# EAGLE design LCmeter0-LCD-8pinlcd-PICCOMP (EAGLE 7.2.0)
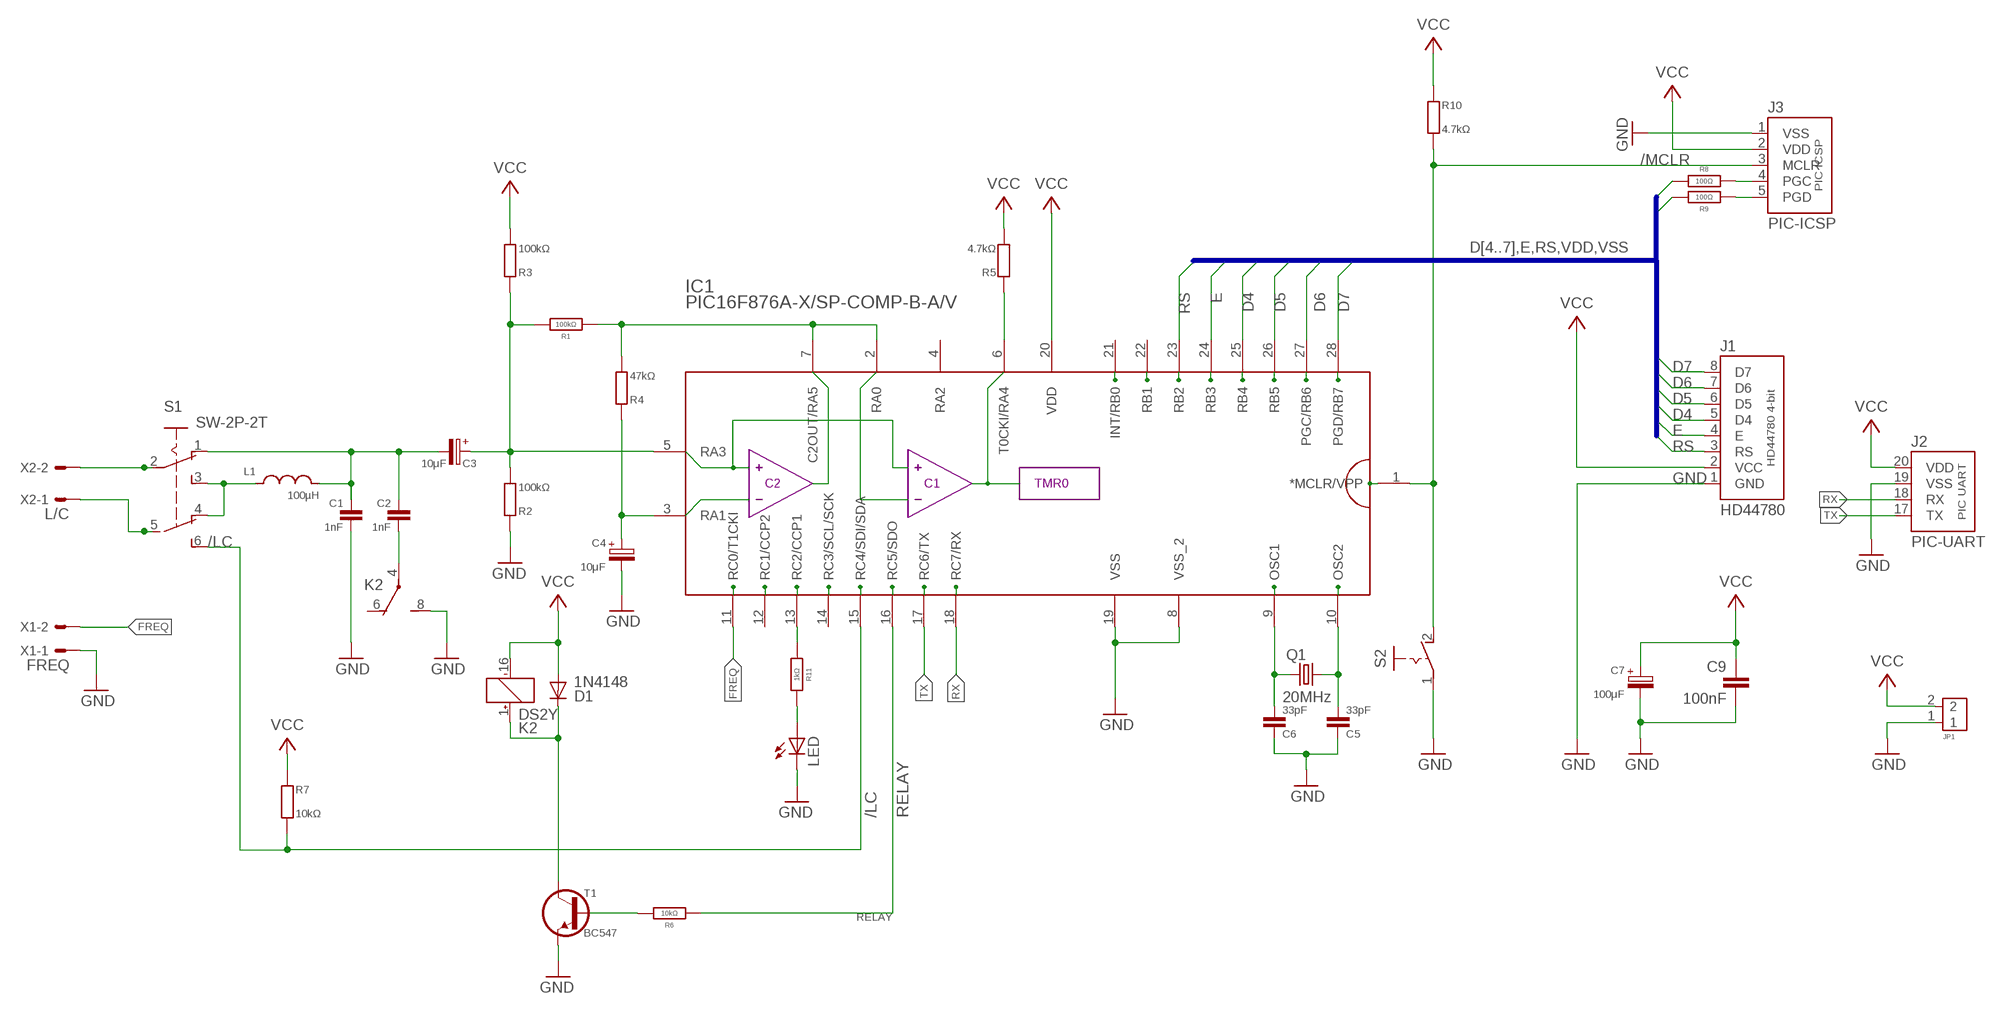
[diagram p0: schematic, sheet 1]

## Parts
C1  1nF  C050-020X036  [C050-020X036]
C2  1nF  C050-020X036  [C050-020X036]
C3  10μF  CPOL-HE2,5-4  [E2,5-4]
C4  10μF  CPOLE2,5-4  [E2,5-4]
C5  33pF  C025-020X036  [C025-020X036]
C6  33pF  C025-020X036  [C025-020X036]
C7  100μF  CPOLE2.5-5  [E2,5-5]
C9  100nF  C-EU025-024X044  [C025-024X044]
D1  1N4148  1N414834-7  [DO34-7]
IC1  PIC16F876A-X/SP-COMP-B-A/V  [DIL28-3/V]
J1  HD44780  HD44780-4BIT-8PIN  [CONN-8P]
J2  PIC-UART  [PIC-UART]
J3  PIC-ICSP  [CONN-5P]
JP1  CONN-2P2P/V  [CONN-2P-V]
K2  DS2Y  DS2Y-S-DC5V  [DS2Y]
L1  100µH  L-SHORT02/7V  [L-02/7V]
LED  TLLG4400  [LED3MM]
Q1  20MHz  CRYSTALHC49  [HC49]
R1  100kΩ  R-H0204/10  [0204/10]
R2  100kΩ  R0204/10  [0204/10]
R3  100kΩ  R0204/10  [0204/10]
R4  47kΩ  R0204/10  [0204/10]
R5  4.7kΩ  R0204/10  [0204/10]
R6  10kΩ  R-H0204/10  [0204/10]
R7  10kΩ  R0204/10-V  [0204/10-V]
R8  100Ω  R-H0204/10  [0204/10]
R9  100Ω  R-H0204/10  [0204/10]
R10  4.7kΩ  R0204/10  [0204/10]
R11  1kΩ  R-H0204/10  [0204/10]
S1  SW-2P-2T  [SLSW-2P2T]
S2  PB-1P-1T  [PB-1P1T]
T1  BC547  [TO92-CBE]
X1  FREQ  C-GRID-02-70543  [70543-02]
X2  L/C  C-GRID-02-70543  [70543-02]

## Nets
/LC: IC1.15(RC4/SDI/SDA) R7.2 S1.6(S1)
/MCLR: IC1.1(*MCLR/VPP) J3.3(MCLR) R10.2 S2.2(S)
/RELAY: D1.C K2.1(1:+) T1.C
A0: IC1.2(RA0) IC1.7(C2OUT/RA5) R1.1 R4.2
A1: C4.+ IC1.3(RA1) R4.1
A3: C3.+ IC1.5(RA3) R1.2 R2.2 R3.1
A4: IC1.6(T0CKI/RA4) R5.1
C2_CON: C2.2 K2.4(2:P)
D4: IC1.25(RB4) J1.5(D4)
D5: IC1.26(RB5) J1.6(D5)
D6: IC1.27(PGC/RB6) J1.7(D6) R9.1
D7: IC1.28(PGD/RB7) J1.8(D7) R8.1
E: IC1.24(RB3) J1.4(E)
FREQ: IC1.11(RC0/T1CKI) X1.2
GND: C1.2 C4.- C5.1 C6.1 C7.- C9.2 IC1.8(VSS_2) IC1.19(VSS) J1.1(GND) J2.19(VSS) J3.1(VSS) JP1.1 K2.8(2:S) LED.K(C) R2.1 S2.1(P) T1.E X1.1
M+: S1.2(P) X2.2
M-: S1.5(P1) X2.1
N$1: J3.4(PGC) R8.2
N$2: C1.1 C2.1 C3.- L1.2 S1.1(O)
N$3: J3.5(PGD) R9.2
N$4: IC1.13(RC2/CCP1) R11.2
N$5: R6.1 T1.B
N$6: LED.A R11.1
N$7: L1.1 S1.3(S) S1.4(O1)
OSC1: C6.2 IC1.9(OSC1) Q1.1
OSC2: C5.2 IC1.10(OSC2) Q1.2
RELAY: IC1.16(RC5/SDO) R6.2
RS: IC1.23(RB2) J1.3(RS)
RX: IC1.18(RC7/RX) J2.18(RX)
TX: IC1.17(RC6/TX) J2.17(TX)
VCC: C7.+ C9.1 D1.A IC1.20(VDD) J1.2(VCC) J2.20(VDD) J3.2(VDD) JP1.2 K2.16(1:-) R3.2 R5.2 R7.1 R10.1
Unconnected: IC1.4(RA2) IC1.12(RC1/CCP2) IC1.14(RC3/SCL/SCK) IC1.21(INT/RB0) IC1.22(RB1) K2.6(2:O) K2.9(3:S) K2.11(3:O) K2.13(3:P)

## Buses
D[4..7],E,RS,VDD,VSS

## Library data of the parts
C1 C2 C5 C6 = c:C: CAPACITOR, European symbol
C3 = c:CPOL-H
C4 C7 = c:CPOL: POLARIZED CAPACITOR, European symbol
C9 = rcl:C-EU: CAPACITOR, European symbol
D1 = d:1N4148
IC1 = mcu:PIC16F876A-X/SP-COMP-B-A
J1 = pinconn:HD44780-4BIT
J2 = pinconn:PIC-UART
J3 = pinconn:PIC-ICSP
JP1 = pinconn:CONN-2P
K2 = relay:DS2Y-S-DC*: MINIATURE RELAY NAiS Source: http://www.mew-europe.com/.. en_ds_61005_0023.pdf; MPN: DS2Y-S-DC5V; OC_FARNELL: unknown; OC_NEWARK: 13P3268
L1 = l:L-SHORT
LED = led:TLLG4400: Low Current (2mA) LED 3 mm Tinted Diffused Package color GREEN Source: Data sheet <http://www.farnell.com/datasheets/391098.pdf>; MF: VISHAY SEMICONDUCTOR; OC_FARNELL: 1612435
Q1 = q:CRYSTAL
R1 R6 R8 R9 R11 = r:R-H
R2-R5 R7 R10 = r:R: RESISTOR, European symbol
S1 = sw:SW-2P-2T
S2 = sw:PB-1P-1T
T1 = t:BC547
X1 X2 = con-molex:C-GRID-02: CONNECTOR wire to board 2.54 mm (0.100") pitch header; OC_FARNELL: unknown; OC_NEWARK: unknown

## Net classes
0 default: clearance 0.381 mm

## Board
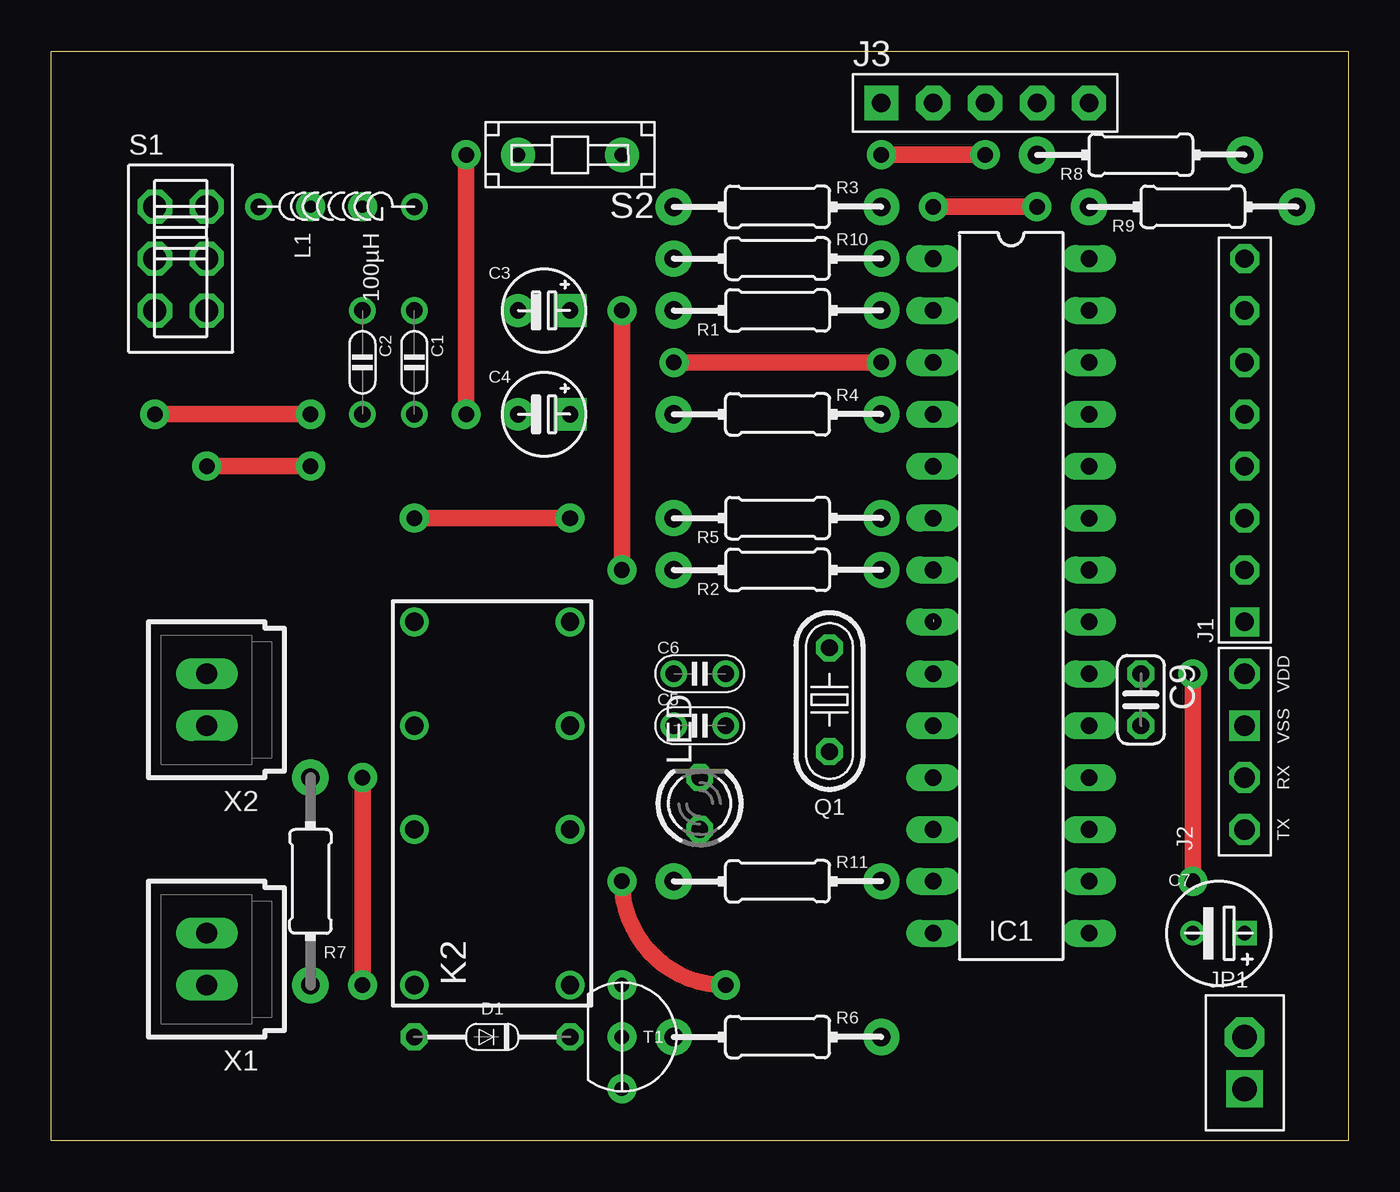
[diagram p1: board, top side]
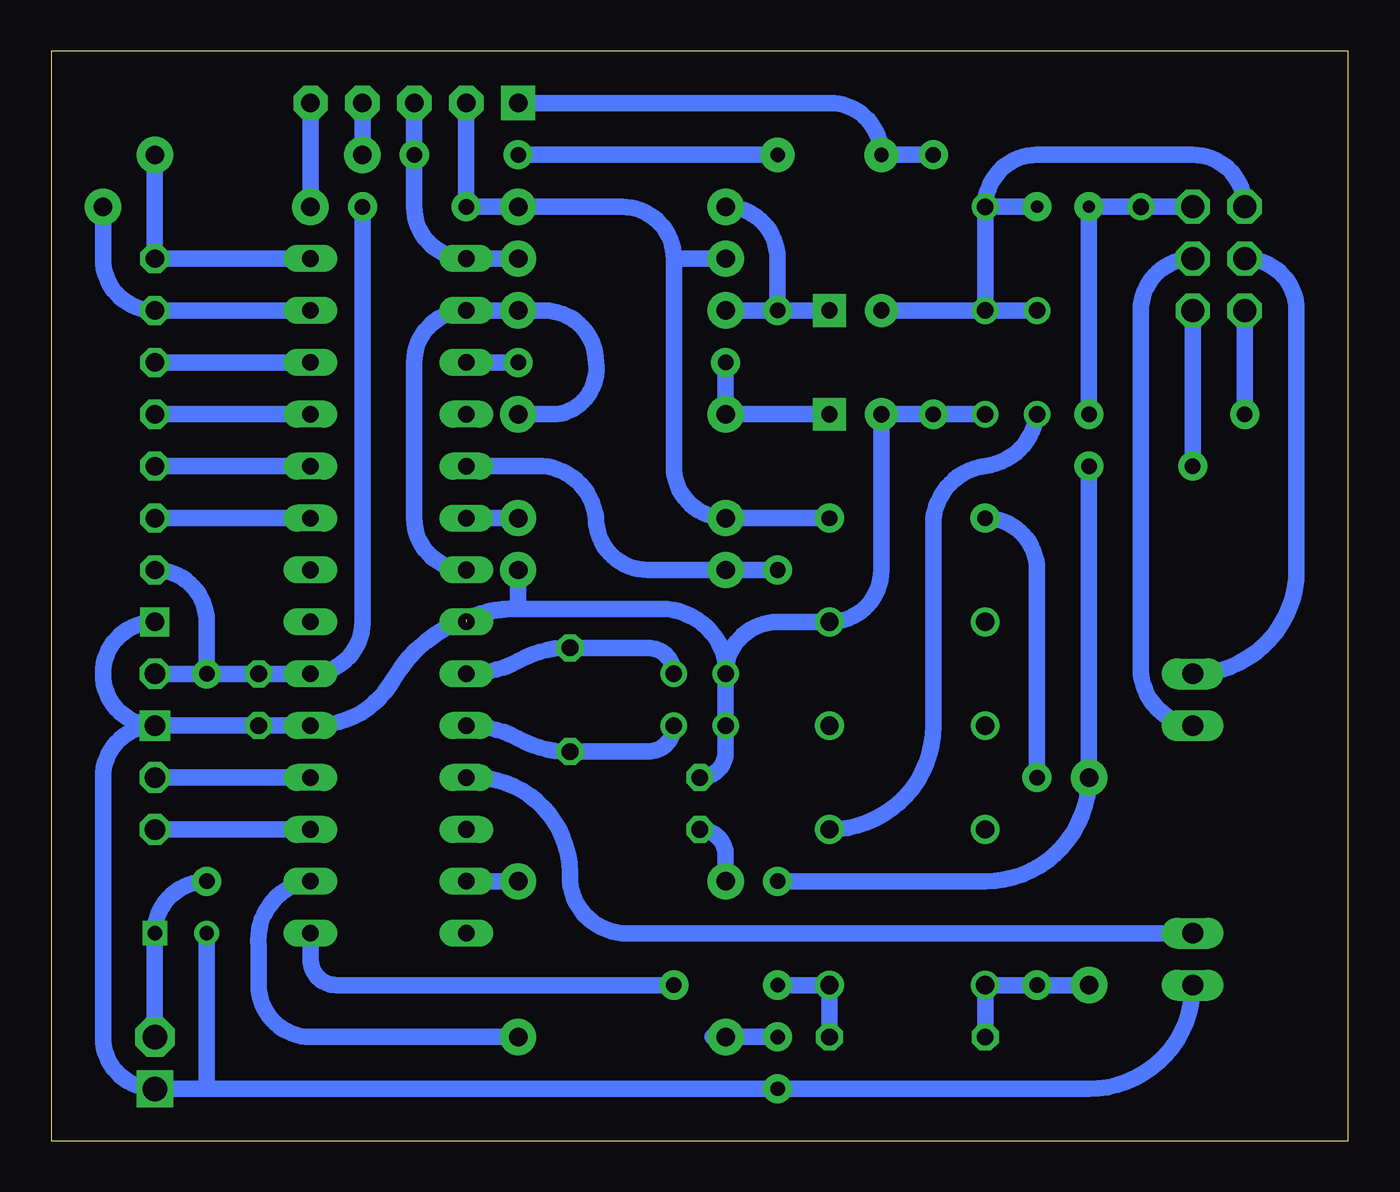
[diagram p2: board, bottom side, seen from below]

Size 63.5 x 53.34 mm. Coordinates in mm from the lower left corner, seen from the top.
Outline: 0,0 0,53.34 63.5,53.34 63.5,0 0,0
Copper layers (1*16): Top 0.035mm / dielectric 1.5mm / Bottom 0.035mm
Design rules "default": minimum track width 10mil, minimum drill 24mil, track to track 8mil, track to pad 8mil, pad to pad 8mil, via to via 8mil, smd to smd 8mil, copper to edge 40mil, drill to drill 8mil, minimum pad ring 10mil, minimum via ring 8mil, stop-mask expansion 4mil, vias tented up to drill 0mil, thermal gap 10mil

### Footprints (pad centres in the part's own frame; a part is rotated, then mirrored left to right if it is on the bottom)
C050-020X036 = drill 0.8: 1 -2.54,0; 2 2.54,0
E2,5-4 = drill 0.8 pad 1.6 square: + 1.27,0 | drill 0.8 pad 1.6: - -1.27,0
C025-020X036 = drill 0.8: 1 0,0; 2 2.54,0
E2,5-5 = drill 0.7 square: + 1.27,0 | drill 0.7: - -1.27,0
C025-024X044 = drill 0.813 octagon: 1 -1.27,0; 2 1.27,0
DO34-7 = drill 0.813 octagon: A -3.81,0; C 3.81,0
DIL28-3/V = drill 0.813 long: 1 -3.81,16.51; 2 -3.81,13.97; 3 -3.81,11.43; 4 -3.81,8.89; 5 -3.81,6.35; 6 -3.81,3.81; 7 -3.81,1.27; 8 -3.81,-1.27; 9 -3.81,-3.81; 10 -3.81,-6.35; 11 -3.81,-8.89; 12 -3.81,-11.43; 13 -3.81,-13.97; 14 -3.81,-16.51; 15 3.81,-16.51; 16 3.81,-13.97; 17 3.81,-11.43; 18 3.81,-8.89; 19 3.81,-6.35; 20 3.81,-3.81; 21 3.81,-1.27; 22 3.81,1.27; 23 3.81,3.81; 24 3.81,6.35; 25 3.81,8.89; 26 3.81,11.43; 27 3.81,13.97; 28 3.81,16.51
CONN-8P = drill 0.9 pad 1.422 square: 1 0,0 | drill 0.9 pad 1.422 octagon: 2 2.54,0; 3 5.08,0; 4 7.62,0; 5 10.16,0; 6 12.7,0; 7 15.24,0; 8 17.78,0
PIC-UART = drill 1 octagon: 17 0,0; 18 0,2.54; 20 0,7.62 | drill 1 square: 19 0,5.08
CONN-5P = drill 0.9 pad 1.676 square: 1 0,0 | drill 0.9 pad 1.676 octagon: 2 2.54,0; 3 5.08,0; 4 7.62,0; 5 10.16,0
CONN-2P-V = drill 1.2 pad 1.778 square: 1 0,-1.27 | drill 1.2 pad 1.93 octagon: 2 0,1.27
DS2Y = drill 0.9: 1 -8.89,-3.81; 4 -1.27,-3.81; 6 3.81,-3.81; 8 8.89,-3.81; 9 8.89,3.81; 11 3.81,3.81; 13 -1.27,3.81; 16 -8.89,3.81
L-02/7V = drill 0.8: 1 0,3.81; 2 0,-3.81
LED3MM = drill 0.813 octagon: A -1.27,0; K 1.27,0
HC49 = drill 0.813 octagon: 1 0,-2.54; 2 0,2.54
0204/10 = drill 0.9 pad 1.778: 1 -5.08,0; 2 5.08,0
0204/10-V = drill 0.9 pad 1.778: 1 0,5.08; 2 0,-5.08
SLSW-2P2T = drill 1.118 pad 1.524 octagon: 1 2.54,1.27; 2 0,1.27; 3 -2.54,1.27; 4 2.54,-1.27; 5 0,-1.27; 6 -2.54,-1.27
PB-1P1T = drill 0.7 pad 1.676: 1 2.54,0; 2 -2.54,0
TO92-CBE = drill 0.7 pad 1.422: B 0,0; C 0,2.54; E 0,-2.54
70543-02 = drill 1.016 long: 1 -1.27,0; 2 1.27,0

### Placement (x,y rotation side)
C1  17.78,38.1 270 top
C2  15.24,38.1 270 top
C3  24.13,40.64 0 top
C4  24.13,35.56 0 top
C5  30.48,20.32 0 top
C6  30.48,22.86 0 top
C7  57.15,10.16 0 top
C9  53.34,21.59 270 top
D1  21.59,5.08 0 top
IC1  46.99,26.67 0 top
J1  58.42,25.4 90 top
J2  58.42,15.24 0 top
J3  40.64,50.8 0 top
JP1  58.42,3.81 0 top
K2  21.59,16.51 90 top
L1  13.97,45.72 90 top
LED  31.75,16.51 90 top
Q1  38.1,21.59 180 top
R1  35.56,40.64 180 top
R2  35.56,27.94 180 top
R3  35.56,45.72 0 top
R4  35.56,35.56 0 top
R5  35.56,30.48 180 top
R6  35.56,5.08 0 top
R7  12.7,12.7 180 top
R8  53.34,48.26 180 top
R9  55.88,45.72 180 top
R10  35.56,43.18 0 top
R11  35.56,12.7 0 top
S1  6.35,43.18 90 top
S2  25.4,48.26 180 top
T1  27.94,5.08 0 top
X1  7.62,8.89 90 top
X2  7.62,21.59 90 top

### Tracks (layer width: path | path; a pad name or v marks a point on that pad's centre or on a via)
/LC  (via drill 0.76 pad 1.42)
  Top 0.813: v33.02,7.62 arc-90 v27.94,12.7 | v12.7,33.02 v7.62,33.02
  Bottom 0.813: IC1.15 50.8,8.89 arc-90 49.53,7.62 v33.02,7.62 | v27.94,12.7 17.78,12.7 arc-90 R7.2 v12.7,33.02 | v7.62,33.02 S1.6
/MCLR  (via drill 0.76 pad 1.42)
  Top 0.813: v45.72,48.26 v40.64,48.26
  Bottom 0.813: J3.3 v45.72,48.26 45.72,45.72 arc-90 IC1.1 R10.2 | v40.64,48.26 S2.2
/RELAY
  Bottom 0.813: D1.C K2.1 T1.C
A0
  Bottom 0.813: R4.2 38.73,35.56 arc-90 36.83,38.1 arc-90 39.37,40.64 R1.1 IC1.2 arc-90 45.72,38.1 45.72,30.48 arc-90 IC1.7
A1  (via drill 0.76 pad 1.42)
  Top 0.813: v40.64,38.1 v30.48,38.1
  Bottom 0.813: IC1.3 v40.64,38.1 | v30.48,38.1 R4.1 C4.+
A3  (via drill 0.76 pad 1.42)
  Top 0.813: v27.94,40.64 v27.94,27.94
  Bottom 0.813: IC1.5 40.01,33.02 arc90 36.83,30.48 arc-90 34.29,27.94 R2.2 v27.94,27.94 | R3.1 arc90 27.94,43.18 v27.94,40.64 | R1.2 v27.94,40.64 | C3.+ v27.94,40.64
A4
  Bottom 0.813: IC1.6 R5.1
C2_CON
  Bottom 0.813: C2.2 arc75 17.78,33.02 arc-75 20.32,30.48 20.32,20.32 arc90 K2.4
D4
  Bottom 0.813: IC1.25 J1.5
D5
  Bottom 0.813: J1.6 IC1.26
D6
  Bottom 0.813: IC1.27 J1.7 arc90 60.96,43.18 R9.1
D7
  Bottom 0.813: R8.1 J1.8 IC1.28
E
  Bottom 0.813: J1.4 IC1.24
FREQ
  Bottom 0.813: IC1.11 42.55,17.78 arc90 38.1,12.7 arc-80 35.56,10.16 X1.2 6.99,10.16
GND  (via drill 0.76 pad 1.42)  (1 unrouted)
  Top 0.813: v20.32,48.26 v20.32,35.56
  Bottom 0.813: J2.19 C9.2 IC1.19 50.55,20.32 arc-60 46.74,22.61 arc60 40.64,26.04 | J2.19 arc-90 60.96,17.78 60.96,5.08 arc-90 JP1.1 55.88,2.54 | C7.- 55.88,2.54 | LED.K arc-90 30.48,19.05 C5.1 C6.1 | 40.64,26.04 33.66,26.04 arc77 30.48,23.5 arc25 C6.1 | 55.88,2.54 T1.E 12.7,2.54 arc-90 X1.1 | 40.64,26.04 R2.1 | J3.1 25.4,50.8 arc90 S2.1 v20.32,48.26 | C1.2 v20.32,35.56 C4.- 22.86,27.94 arc90 K2.8 27.94,25.4 arc-90 C6.1 | J2.19 arc90 60.96,22.86 arc90 J1.1 | IC1.8 43.18,25.53 arc30 40.64,26.04
M+
  Bottom 0.813: X2.2 arc-90 2.54,27.94 2.54,40.64 arc-90 S1.2
M-
  Bottom 0.813: S1.5 arc-90 10.16,40.64 10.16,22.86 arc-77 X2.1
N$1
  Bottom 0.813: J3.4 R8.2
N$2
  Bottom 0.813: C3.- C1.1 | C1.1 C2.1 | S1.1 arc-90 7.62,48.26 15.24,48.26 arc-90 L1.2 | 15.24,45.72 L1.2 | L1.2 C1.1
N$3
  Bottom 0.813: R9.2 J3.5
N$4
  Bottom 0.813: R11.2 IC1.13
N$5
  Bottom 0.813: T1.B R6.1 31.11,5.08
N$6
  Bottom 0.813: R11.1 30.48,13.97 arc-90 LED.A
N$7  (via drill 0.76 pad 1.42)
  Top 0.813: v5.08,35.56 v12.7,35.56
  Bottom 0.813: S1.4 9.4,45.72 L1.1 12.7,45.72 v12.7,35.56 | 5.08,40.01 S1.3 v5.08,35.56
N$8  (via drill 0.6 pad 1.42)
  other vias: 12.7,45.72
N$9  (via drill 0.6 pad 1.42)
  other vias: 15.24,45.72
OSC1
  Bottom 0.813: IC1.9 arc-30 40.64,23.5 arc30 Q1.1 34.29,24.13 arc90 C6.2
OSC2
  Bottom 0.813: IC1.10 arc30 40.64,19.68 arc-30 Q1.2 34.29,19.05 arc-90 C5.2
RELAY
  Bottom 0.813: IC1.16 arc-90 53.34,9.53 53.34,7.62 arc-90 50.8,5.08 R6.2
RS
  Bottom 0.813: IC1.23 J1.3
RX
  Bottom 0.813: IC1.18 J2.18
TX
  Bottom 0.813: IC1.17 J2.17
VCC  (via drill 0.76 pad 1.42)
  Top 0.813: v48.26,45.72 v43.18,45.72 | v55.88,12.7 v55.88,22.86 | v25.4,30.48 v17.78,30.48 | v15.24,17.78 v15.24,7.62
  Bottom 0.813: v48.26,45.72 48.26,25.4 arc90 IC1.20 C9.1 v55.88,22.86 | J3.2 v43.18,45.72 R3.2 35.56,45.72 arc90 33.02,43.18 | J1.2 arc90 55.88,25.4 v55.88,22.86 | v55.88,22.86 J2.20 | JP1.2 C7.+ arc90 v55.88,12.7 | R10.1 33.02,43.18 | 33.02,43.18 33.02,33.02 arc-90 R5.2 v25.4,30.48 | D1.A K2.16 v15.24,7.62 R7.1 | v17.78,30.48 arc90 15.24,27.94 v15.24,17.78